# Altium schematic sheet USB_AB.SchDoc
size A4
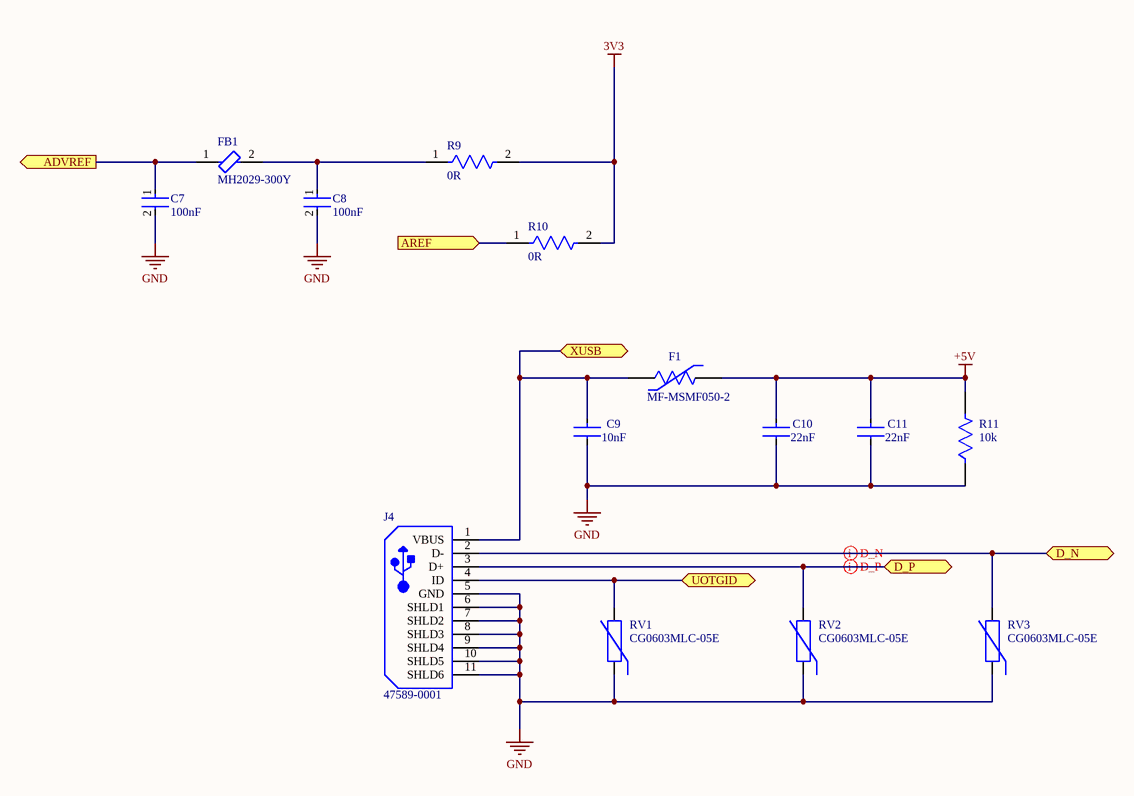
[diagram p0: USB_AB.SchDoc]

## Parts
C7  100nF  [FP-0805-L_2_01_0_2-W_1_25-IPC_B]
C8  100nF  [FP-0805-L_2_01_0_2-W_1_25-IPC_B]
C9  10nF  [FP-GRM219-0_1-IPC_B]
C10  22nF  [FP-GRM21B-0_1-IPC_A]
C11  22nF  [FP-GRM21B-0_1-IPC_A]
F1  MF-MSMF050-2  [FP-MF-MSMF050-2-MFG]
FB1  MH2029-300Y  [FP-MH2029-MFG]
J4  47589-0001  [MOLX-47589-0001_V]
R9  0R  [FP-CRCW0805-e3-IPC_B]
R10  0R  [FP-CRCW0805-e3-IPC_B]
R11  10k  [FP-CRCW0805-e3-IPC_A]
RV1  CG0603MLC-05E  [BOUR-CG0603-2_V]
RV2  CG0603MLC-05E  [BOUR-CG0603-2_V]
RV3  CG0603MLC-05E  [BOUR-CG0603-2_V]

## Ports
ADVREF (out), AREF (in), D_N (bidir), D_P (bidir), UOTGID (bidir), XUSB (bidir)

## Nets
3V3: R9.2 R10.2
+5V: C10.1 C11.1 F1.2 R11.2
GND: C7.2 C8.2 C9.2 C10.2 C11.2 J4.5(GND) J4.6(SHLD1) J4.7(SHLD2) J4.8(SHLD3) J4.9(SHLD4) J4.10(SHLD5) J4.11(SHLD6) R11.1 RV1.1 RV2.1 RV3.1
ADVREF: C7.1 FB1.1 ; port ADVREF
AREF: R10.1 ; port AREF
D_N: J4.2(D-) RV3.2 ; port D_N
D_P: J4.3(D+) RV2.2 ; port D_P
UOTGID: J4.4(ID) RV1.2 ; port UOTGID
XUSB: C9.1 F1.1 J4.1(VBUS) ; port XUSB
NetC8_1: C8.1 FB1.2 R9.1

## Layout directives
differential pair: D_N, D_P

## Library data of the parts
C7 C8 = CMP-2007-04174-2: General Purpose Ceramic Capacitor, 0805, 100nF, 10%, X7R, 15%, 100V; Packaging: Tape and Reel; Min Operating Temperature: -55°C; Dielectric Material: Ceramic; Height: 1.4mm; Voltage Rating: 100V; Termination: SMD/SMT; Case Code (Imperial): 0805; Case Code (Metric): 2012; Case/Package: 0805; Construction: Flat; Radiation Hardening: No; Series: -; Dielectric: X7R; Package Quantity: 2000; Mount: Surface Mount; Capacitance: 100nF; Contact Plating: Tin; Voltage: 100V; Lead Free: Lead Free; Depth: 1.25mm; RoHS Compliant: Yes; Number of Pins: 2; Max Operating Temperature: 125°C; Length: 2.01mm; Voltage Rating (DC): 100V; Thickness: 0.055inch; REACH SVHC: No SVHC; Width: 0.049inch; Tolerance: 10%
C9 = CMP-2007-00135-2: Chip Multilayer Ceramic Capacitors for General Purpose, 0805, 10000pF, C0G, 30ppm/°C, 5%, 50V; Insulation Resistance: 10GR; Max Operating Temperature: 125°C; Height: 0.85mm; Voltage: 50V; Dielectric Material: Ceramic; Voltage Rating: 50V; Dielectric: C0G; Thickness: 0.037inch; REACH SVHC: No SVHC; Lead Free: Lead Free; Depth: 1.25mm; Min Operating Temperature: -55°C; Package Quantity: 1; Packaging: Tape and Reel; Case Code (Imperial): 0805; Case/Package: 0805; Mount: Surface Mount; Width: 0.049inch; Case Code (Metric): 2012; Length: 2mm; Termination: SMD/SMT; Material: Ceramic; Tolerance: 5%; Temperature Coefficient: 30ppm/°C; Capacitance: 10nF; Number of Pins: 2; Voltage Rating (DC): 50V; Radiation Hardening: No
C10 C11 = CMP-2007-03457-2: Chip Multilayer Ceramic Capacitors for General Purpose, 0805, 22000pF, C0G, 30ppm/°C, 5%, 50V; Voltage: 25V; Tolerance: 5%; Dielectric: C0G; Material: Ceramic; Case Code (Metric): 2012; Thickness: 0.053inch; Temperature Coefficient: 30ppm/°C; Lead Free: Lead Free; Height: 1.25mm; Radiation Hardening: No; Max Operating Temperature: 125°C; Termination: SMD/SMT; Mount: Surface Mount; Case Code (Imperial): 0805; Capacitance: 22nF; Packaging: Tape and Reel; Min Operating Temperature: -55°C; Number of Pins: 2; Voltage Rating (DC): 50V; Voltage Rating: 50V; Package Quantity: 1; REACH SVHC: No SVHC; Length: 2mm; Case/Package: 0805; Width: 0.049inch; Depth: 1.25mm
F1 = CMP-2100-03653-2: PTC RESET FUSE 15V 500MA 1812; Manufacturer: Bourns; Value: 0.15-1Ω; Trip Current: 1A; Automotive Grade: Grade 3; Trip Time: 0.15s; Current Rating: 100A; Hold Current: 0.5A; Height: 0.85mm; Package: 1812; Voltage Rating: 15V; Temperature Range High: +85°C; Device Class L2: PTC Resettable Fuses; Lead Free: Yes; ComponentLink2URL: http://www.bourns.com/docs/Product-Datasheets/mfmsmf.pdf; Ambient Temperature Range High: +85°C; Mouser Description: PTC Resettable Fuse 0.5A(hold) 1A(trip) 15V 100A 0.8W 0.15s 0.15Ohm SMD Solder Pad 1812 T/R; Digikey Description: PTC RESET FUSE 15V 500MA 1812; Manufacturer Part Number: MF-MSMF050-2; Resistance: 0.15-1Ω; Category: Fuse; ComponentLink2Description: Datasheet; Automotive: Yes; Temperature Range Low: -40°C; RoHS: TRUE; Device Class L1: Circuit Protection; Temperature: -40°C to +85°C; Octopart: https://octopart.com/mf-msmf050-2-bourns-28047; Ambient Temperature Range Low: -40°C; Device Class L3: unset
FB1 = CMP-07252-000001-1: FERRITE BEAD 30 OHM 0805 1LN; Manufacturer: Bourns; Series Resistance: 25mΩ; Resistance: 30Ω; Value: 30Ω; Impedance At Frequency: 30Ω @ 100MHz; Rms Current: 3A; Tolerance: 25%; RoHS: TRUE; Manufacturer Part Number: MH2029-300Y; Temperature Range High: +125°C; Device Class L3: Ferrite Beads and Chips; Core Material: Ferrite; ComponentLink2Description: Datasheet; Category: FBead; Octopart: https://octopart.com/mh2029-300y-bourns-756929; Digikey Description: FERRITE BEAD 30 OHM 0805 1LN; Device Class L2: EMI / RFI Components; Lead Free: Yes; Mouser Description: Ferrite Beads 30 ohms 25% HIGH CURRENT; Automotive: No; Ipc Land Pattern Name: CAPC200120X90; Temperature: -55°C to +125°C; Device Class L1: Passive Components; Height: 1.1mm; ComponentLink2URL: https://www.bourns.com/docs/Product-Datasheets/mh.pdf; Package: MH2029; Temperature Range Low: -55°C
J4 = CMP-2000-05610-1: Right Angle Female Type AB Micro USB Connector, 30 V, 1.8 A, -30 to 85 degC, RoHS, Tape and Reel; Number of Ports: 1Port; Current Rating: 1.8A; Brand: Molex; Connector Type: MicroUSBTypeABreceptacle; Number of Contacts: 5Contact; Voltage Rating: 30VAC; Color: Black; Product: MicroUSBTypeABConnectors; Package URL: http://www.molex.com/pdm_docs/sd/475890001_sd.pdf; Contact Plating: Gold; Datasheet URL: http://www.molex.com/webdocs/datasheets/pdf/en-us/0475890001_IO_CONNECTORS.pdf; Operating Temperature Range: -20Cto+85C; Termination Style: SMD/SMT; Mounting Angle: Right; Package Reference: 47589-0001; Gender: Female; Package Description: Micro USB Connector, Pitch 0.65 mm, 5 Positions, Body 7.5 x 5.6 mm; Mounting Technology: SurfaceMount; Contact Material: CopperAlloy; Packaging: Reel; RoHS: True; Standard: USB; Manufacturer URL: http://www.molex.com/; Manufacturer: Molex; Datasheet Version: 12/2016; Product Category: USBConnectors; Series: 47589
R9 R10 = CMP-2001-04897-2: RES Thick Film, 0Ω, 0.125W, 0805; Power Rating: 125mW; Resistance: 0mR; Voltage Rating: 150V; Length: 2mm; Width: 0.049inch; Weight: 0.000194oz; Composition: Thick Film; Contact Plating: Tin; Max Power Dissipation: 125mW; Min Operating Temperature: -55°C; Packaging: Tape and Reel; Number of Terminations: 2; Package Quantity: 10000; Case Code (Imperial): 0805; Military Standard: Not; Height: 0.02inch; Features: Automotive AEC-Q200; Depth: 1.25mm; Radiation Hardening: No; Lead Free: Lead Free; Case Code (Metric): 2012; Case/Package: 0805; Voltage Rating (DC): 150V; Termination: SMD/SMT; Max Operating Temperature: 155°C
R11 = CMP-2001-04908-2: RES Thick Film, 10kΩ, 1%, 0.125W, 100ppm/°C, 0805; Resistance: 10kR; Voltage Rating (DC): 150V; Power Rating: 125mW; Weight: 0.000194oz; Package Quantity: 5000; Military Standard: Not; Max Operating Temperature: 155°C; Temperature Coefficient: 100ppm/°C; Contact Plating: Tin; Width: 1.25mm; Height: 0.45mm; Radiation Hardening: No; Tolerance: 1%; Min Operating Temperature: -55°C; Voltage Rating: 150V; Length: 2mm; Depth: 1.25mm; Termination: SMD/SMT; Packaging: Tape and Reel; Case/Package: 0805; Case Code (Metric): 2012; Lead Free: Lead Free; Case Code (Imperial): 0805; Composition: Thick Film
RV1-RV3 = CMP-0584-00001-2: ESD Protector, 5 V Supply, -40 to 85 degC, 1.6 x 0.8 x 0.55 mm SMD, RoHS, Tape and Reel; Manufacturer: Bourns; VC: 20 V; VT: 150 V; RT: 1 ns; VDC: 5 V; CO: 0.5 pF; PartNumber: CG0603MLC-05E; ComponentLink1Description: Manufacturer URL; ComponentLink1URL: http://www.bourns.com/; Packing: Tape and Reel; Mounting Technology: Surface Mount; ComponentLink2Description: Datasheet; RoHS: TRUE; Operating Temperature: -40 to 85 degC; DatasheetVersion: Rev. S; PackageDescription: 2-Pin SMD, Body 1.6 x 0.8 mm, Pitch 1.52 mm; PackageReference: CG0603-2; ComponentLink2URL: http://www.bourns.com/data/global/pdfs/MLC.pdf